# EAGLE board ra8875_ez80_2_1 (EAGLE 7.3.0), part 1 of 2
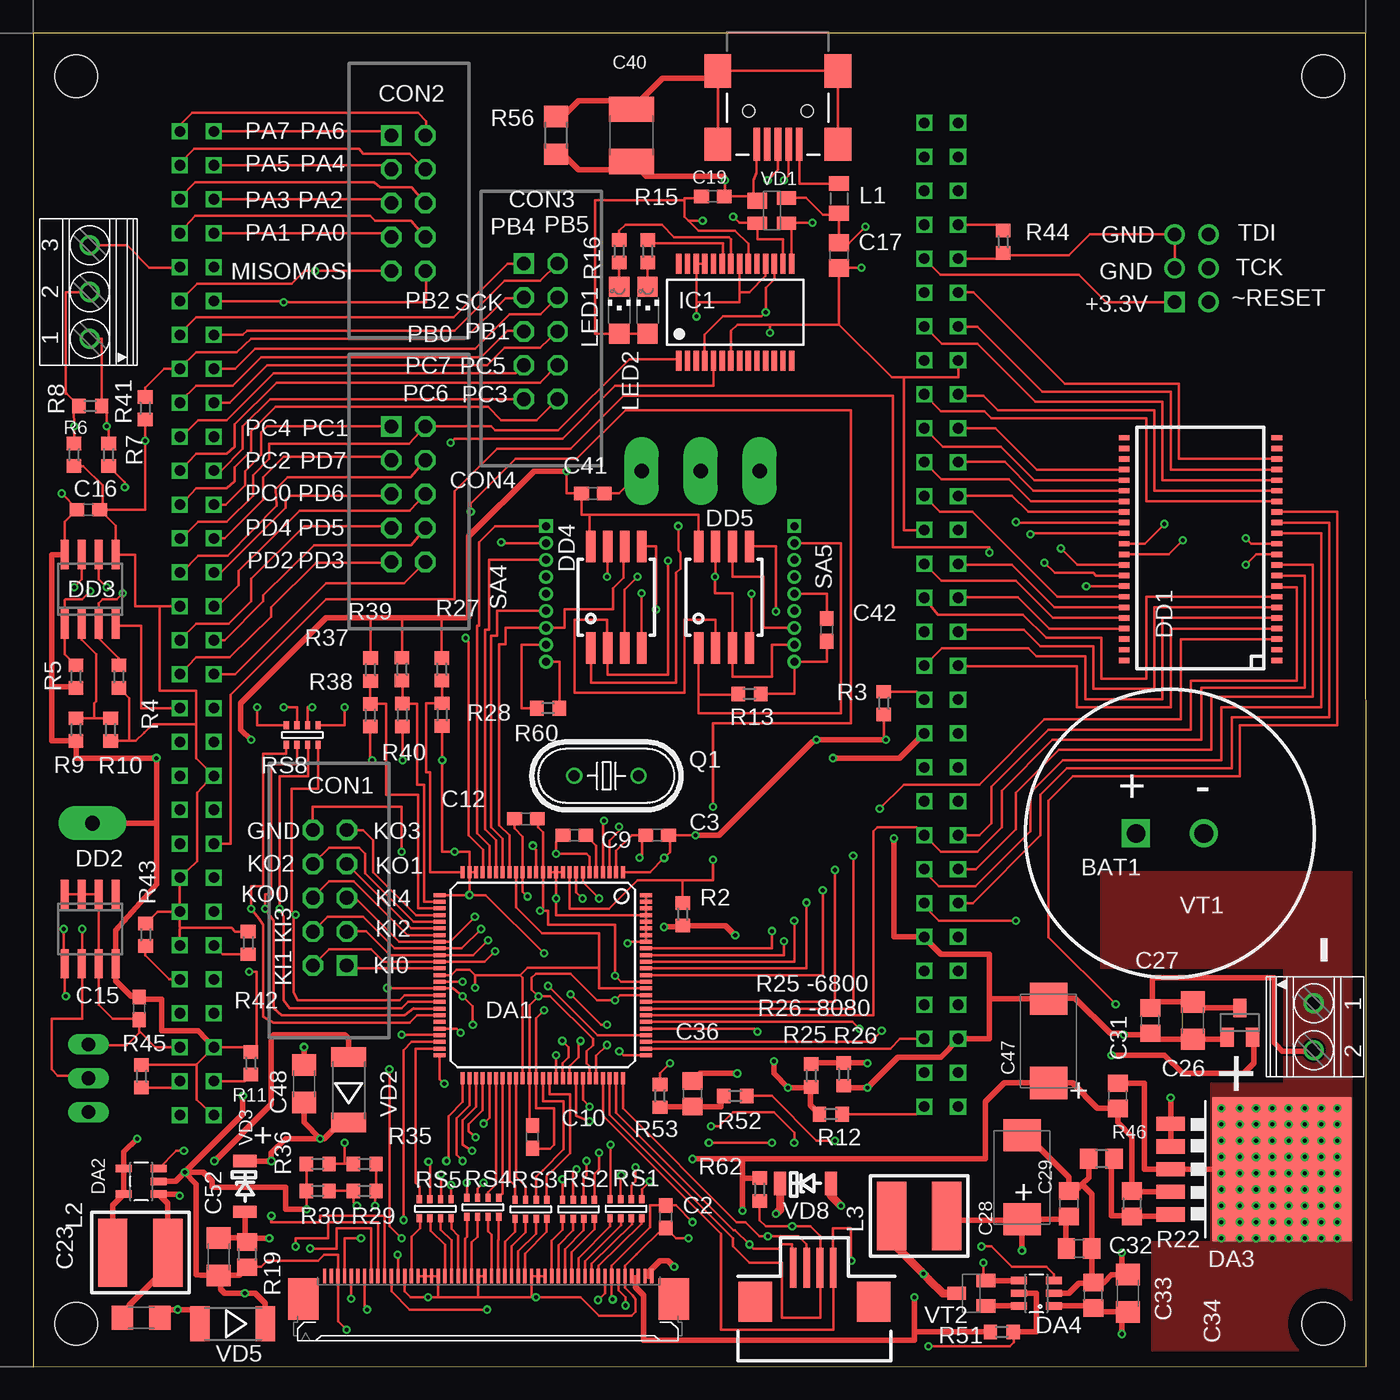
[diagram p2: board, top side]
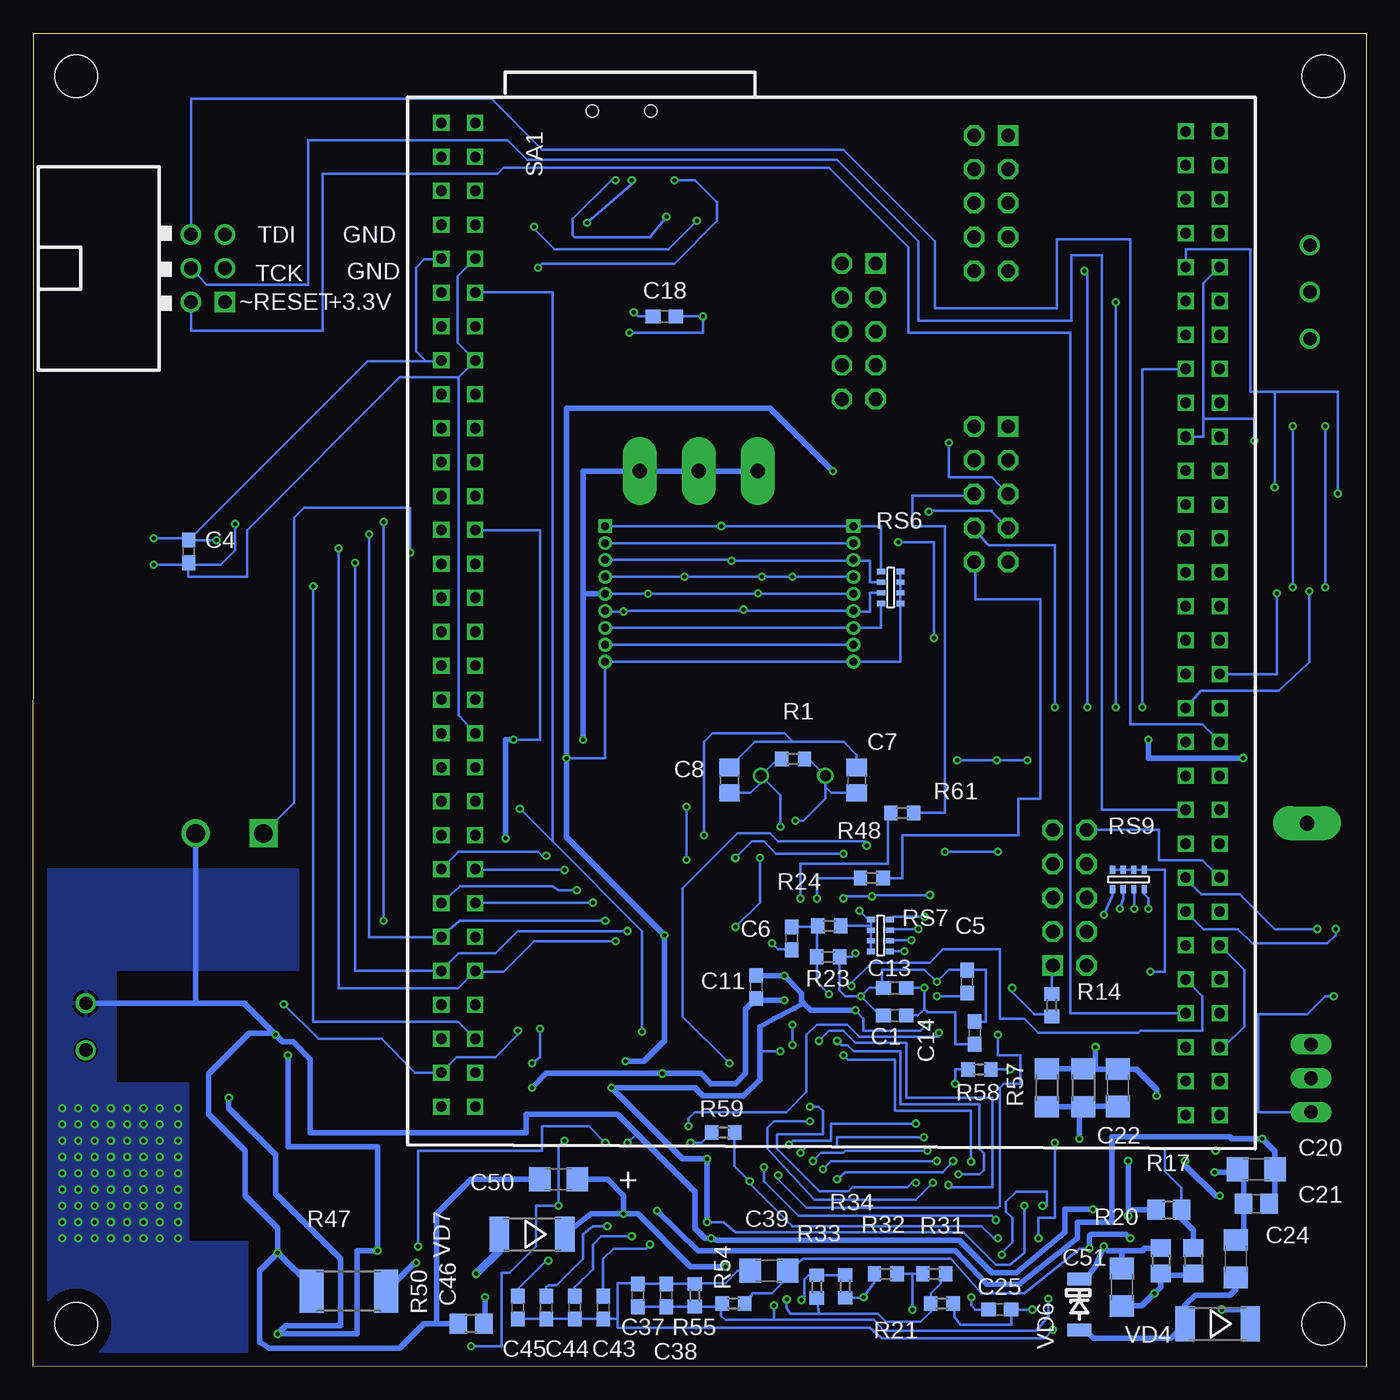
[diagram p3: board, bottom side, seen from below]

Size 99.84 x 99.83 mm. Coordinates in mm from the lower left corner, seen from the top.
Outline: 0,0 99.84,0.01 99.83,99.83 0,99.83 0,0
Copper layers (1*16): Top 0.035mm / dielectric 1.5mm / Bottom 0.035mm
Design rules "seeedstudio": minimum track width 6mil, minimum drill 11mil, track to track 6mil, track to pad 6mil, pad to pad 6mil, via to via 12mil, smd to smd 3mil, copper to edge 40mil, drill to drill 12mil, minimum pad ring 6mil, minimum via ring 6mil, stop-mask expansion 2mil, vias tented up to drill 16mil, thermal gap 10mil
Holes 3.2 mm at 3.2,96.62 96.62,96.62 96.62,3.2 3.2,3.2

## Footprints (pad centres in the part's own frame; a part is rotated, then mirrored left to right if it is on the bottom)
EECF5R5U155 = drill 1.4 square: + 0,0 | drill 1.4: - 5.08,0
C0603 = smd 1.1 x 1: 1 -0.85,0; 2 0.85,0
C0805 = smd 1.3 x 1.5: 1 -0.95,0; 2 0.95,0
C1206 = smd 1.6 x 1.8: 1 -1.4,0; 2 1.4,0
SMC_D = smd 2.4 x 2.8: + -3.15,0; - 3.15,0
C1812 = smd 1.9 x 3.4: 1 -1.95,0; 2 1.95,0
FPC_1MM-4 = smd 0.5 x 3: 1 0,0; 2 1,0; 3 2,0; 4 3,0 | smd 2.5 x 3: NC -2.857,-2.54; NC1 6.032,-2.54
IDC10 = drill 1.02 square: 1 0,0 | drill 1.02 octagon: 2 0,2.54; 3 2.54,0; 4 2.54,2.54; 5 5.08,0; 6 5.08,2.54; 7 7.62,0; 8 7.62,2.54; 9 10.16,0; 10 10.16,2.54
LQFP100 = smd 0.9 x 0.3: 1 -7.72,6; 2 -7.72,5.5; 3 -7.72,5; 4 -7.72,4.5; 5 -7.72,4; 6 -7.72,3.5; 7 -7.72,3; 8 -7.72,2.5; 9 -7.72,2; 10 -7.72,1.5; 11 -7.72,1; 12 -7.72,0.5; 13 -7.72,0; 14 -7.72,-0.5; 15 -7.72,-1; 16 -7.72,-1.5; 17 -7.72,-2; 18 -7.72,-2.5; 19 -7.72,-3; 20 -7.72,-3.5; 21 -7.72,-4; 22 -7.72,-4.5; 23 -7.72,-5; 24 -7.72,-5.5; 25 -7.72,-6; 51 7.72,-6; 52 7.72,-5.5; 53 7.72,-5; 54 7.72,-4.5; 55 7.72,-4; 56 7.72,-3.5; 57 7.72,-3; 58 7.72,-2.5; 59 7.72,-2; 60 7.72,-1.5; 61 7.72,-1; 62 7.72,-0.5; 63 7.72,0; 64 7.72,0.5; 65 7.72,1; 66 7.72,1.5; 67 7.72,2; 68 7.72,2.5; 69 7.72,3; 70 7.72,3.5; 71 7.72,4; 72 7.72,4.5; 73 7.72,5; 74 7.72,5.5; 75 7.72,6 | smd 0.3 x 0.9: 26 -6,-7.72; 27 -5.5,-7.72; 28 -5,-7.72; 29 -4.5,-7.72; 30 -4,-7.72; 31 -3.5,-7.72; 32 -3,-7.72; 33 -2.5,-7.72; 34 -2,-7.72; 35 -1.5,-7.72; 36 -1,-7.72; 37 -0.5,-7.72; 38 0,-7.72; 39 0.5,-7.72; 40 1,-7.72; 41 1.5,-7.72; 42 2,-7.72; 43 2.5,-7.72; 44 3,-7.72; 45 3.5,-7.72; 46 4,-7.72; 47 4.5,-7.72; 48 5,-7.72; 49 5.5,-7.72; 50 6,-7.72; 76 6,7.72; 77 5.5,7.72; 78 5,7.72; 79 4.5,7.72; 80 4,7.72; 81 3.5,7.72; 82 3,7.72; 83 2.5,7.72; 84 2,7.72; 85 1.5,7.72; 86 1,7.72; 87 0.5,7.72; 88 0,7.72; 89 -0.5,7.72; 90 -1,7.72; 91 -1.5,7.72; 92 -2,7.72; 93 -2.5,7.72; 94 -3,7.72; 95 -3.5,7.72; 96 -4,7.72; 97 -4.5,7.72; 98 -5,7.72; 99 -5.5,7.72; 100 -6,7.72
SOT23-5L = smd 0.55 x 1.2: 1 -0.95,-1.3; 2 0,-1.3; 3 0.95,-1.3; 4 0.95,1.3; 5 -0.95,1.3
TO263-5 = smd 1.067 x 2.159: 1 -3.404,-5.791; 2 -1.702,-5.791; 3 0,-5.791; 4 1.702,-5.791; 5 3.404,-5.791 | smd 10.8 x 10.41: 6 0,2.54
SOT23-6L = smd 0.55 x 1.2: 1 -0.95,-1.3; 2 0,-1.3; 3 0.95,-1.3; 4 0.95,1.3; 5 0,1.3; 6 -0.95,1.3
TSOP_Z44_II = smd 0.4 x 0.8: 1 0,0; 2 0.794,0; 3 1.587,0; 4 2.381,0; 5 3.175,0; 6 3.969,0; 7 4.763,0; 8 5.556,0; 9 6.35,0; 10 7.144,0; 11 7.938,0; 12 8.731,0; 13 9.525,0; 14 10.319,0; 15 11.113,0; 16 11.906,0; 17 12.7,0; 18 13.494,0; 19 14.287,0; 20 15.081,0; 21 15.875,0; 22 16.669,0; 23 16.669,11.43; 24 15.875,11.43; 25 15.081,11.43; 26 14.287,11.43; 27 13.494,11.43; 28 12.7,11.43; 29 11.906,11.43; 30 11.113,11.43; 31 10.319,11.43; 32 9.525,11.43; 33 8.731,11.43; 34 7.938,11.43; 35 7.144,11.43; 36 6.35,11.43; 37 5.556,11.43; 38 4.763,11.43; 39 3.969,11.43; 40 3.175,11.43; 41 2.381,11.43; 42 1.587,11.43; 43 0.794,11.43; 44 0,11.43
SOIC8 = smd 0.6 x 2.2: 1 -1.905,-2.6; 2 -0.635,-2.6; 3 0.635,-2.6; 4 1.905,-2.6; 5 1.905,2.6; 6 0.635,2.6; 7 -0.635,2.6; 8 -1.905,2.6
SO8 = smd 0.6 x 2.2: 1 -1.905,-2.6; 2 -0.635,-2.6; 3 0.635,-2.6; 4 1.905,-2.6; 5 1.905,2.6; 6 0.635,2.6; 7 -0.635,2.6; 8 -1.905,2.6
SOIC-208 = smd 0.7 x 2.36: 1 0,0; 2 1.27,0; 3 2.54,0; 4 3.81,0; 5 3.81,7.62; 6 2.54,7.62; 7 1.27,7.62; 8 0,7.62
SSOP28 = smd 0.4 x 1.5: 1 -4.225,-3.625; 2 -3.575,-3.625; 3 -2.925,-3.625; 4 -2.275,-3.625; 5 -1.625,-3.625; 6 -0.975,-3.625; 7 -0.325,-3.625; 8 0.325,-3.625; 9 0.975,-3.625; 10 1.625,-3.625; 11 2.275,-3.625; 12 2.925,-3.625; 13 3.575,-3.625; 14 4.225,-3.625; 15 4.225,3.625; 16 3.575,3.625; 17 2.925,3.625; 18 2.275,3.625; 19 1.625,3.625; 20 0.975,3.625; 21 0.325,3.625; 22 -0.325,3.625; 23 -0.975,3.625; 24 -1.625,3.625; 25 -2.275,3.625; 26 -2.925,3.625; 27 -3.575,3.625; 28 -4.225,3.625
4-1734839-0 = smd 0.25 x 1.1: 1 -11.973,-2.54; 2 -11.473,-2.54; 3 -10.973,-2.54; 4 -10.473,-2.54; 5 -9.973,-2.54; 6 -9.473,-2.54; 7 -8.973,-2.54; 8 -8.473,-2.54; 9 -7.973,-2.54; 10 -7.473,-2.54; 11 -6.973,-2.54; 12 -6.473,-2.54; 13 -5.973,-2.54; 14 -5.473,-2.54; 15 -4.973,-2.54; 16 -4.473,-2.54; 17 -3.973,-2.54; 18 -3.473,-2.54; 19 -2.973,-2.54; 20 -2.473,-2.54; 21 -1.972,-2.54; 22 -1.472,-2.54; 23 -0.973,-2.54; 24 -0.472,-2.54; 25 0.028,-2.54; 26 0.527,-2.54; 27 1.028,-2.54; 28 1.528,-2.54; 29 2.027,-2.54; 30 2.527,-2.54; 31 3.027,-2.54; 32 3.527,-2.54; 33 4.027,-2.54; 34 4.527,-2.54; 35 5.027,-2.54; 36 5.527,-2.54; 37 6.027,-2.54; 38 6.527,-2.54; 39 7.027,-2.54; 40 7.527,-2.54; 41 8.039,-2.54; 42 8.539,-2.54; 43 9.039,-2.54; 44 9.539,-2.54; 45 10.039,-2.54; 46 10.539,-2.54; 47 11.039,-2.54; 48 11.539,-2.54; 49 12.039,-2.54; 50 12.539,-2.54 | smd 2.3 x 3.1: M1 14.119,-0.84; M2 -13.623,-0.84
R0805 = smd 1.1 x 1.5: 1 -1.109,0; 2 1.109,0
VLS6045 = smd 2.2 x 5.1: P$1 0,0; P$2 4.128,0
CHIPLED_1206 = smd 1.5 x 1.5: A 0,-1.75; C 0,1.75
HC49U70 = drill 0.813: 1 -2.413,0; 2 2.413,0
R0603 = smd 1 x 1.1: 1 -0.85,0; 2 0.85,0
R0805' = smd 1.3 x 1.5: 1 -0.95,0; 2 0.95,0
R2512 = smd 1.8 x 3.2: 1 -2.8,0; 2 2.8,0
R1206 = smd 1.6 x 1.803: 1 -1.422,0; 2 1.422,0
CAY16-4 = smd 0.6 x 0.4: 1 0,0; 2 0,-0.794; 3 0,-1.587; 4 0,-2.381; 5 1.429,-2.381; 6 1.429,-1.587; 7 1.429,-0.794; 8 1.429,0
EZ80F916050MODG = drill 0.8 square: JP1_1 0,0; JP1_2 0,2.54; JP1_3 2.54,0; JP1_4 2.54,2.54; JP1_5 5.08,0; JP1_6 5.08,2.54; JP1_7 7.62,0; JP1_8 7.62,2.54; JP1_9 10.16,0; JP1_10 10.16,2.54; JP1_11 12.7,0; JP1_12 12.7,2.54; JP1_13 15.24,0; JP1_14 15.24,2.54; JP1_15 17.78,0; JP1_16 17.78,2.54; JP1_17 20.32,0; JP1_18 20.32,2.54; JP1_19 22.86,0; JP1_20 22.86,2.54; JP1_21 25.4,0; JP1_22 25.4,2.54; JP1_23 27.94,0; JP1_24 27.94,2.54; JP1_25 30.48,0; JP1_26 30.48,2.54; JP1_27 33.02,0; JP1_28 33.02,2.54; JP1_29 35.56,0; JP1_30 35.56,2.54; JP1_31 38.1,0; JP1_32 38.1,2.54; JP1_33 40.64,0; JP1_34 40.64,2.54; JP1_35 43.18,0; JP1_36 43.18,2.54; JP1_37 45.72,0; JP1_38 45.72,2.54; JP1_39 48.26,0; JP1_40 48.26,2.54; JP1_41 50.8,0; JP1_42 50.8,2.54; JP1_43 53.34,0; JP1_44 53.34,2.54; JP1_45 55.88,0; JP1_46 55.88,2.54; JP1_47 58.42,0; JP1_48 58.42,2.54; JP1_49 60.96,0; JP1_50 60.96,2.54; JP1_51 63.5,0; JP1_52 63.5,2.54; JP1_53 66.04,0; JP1_54 66.04,2.54; JP1_55 68.58,0; JP1_56 68.58,2.54; JP1_57 71.12,0; JP1_58 71.12,2.54; JP1_59 73.66,0; JP1_60 73.66,2.54; JP2_1 0.635,55.761; JP2_2 0.635,58.301; JP2_3 3.175,55.761; JP2_4 3.175,58.301; JP2_5 5.715,55.761; JP2_6 5.715,58.301; JP2_7 8.255,55.761; JP2_8 8.255,58.301; JP2_9 10.795,55.761; JP2_10 10.795,58.301; JP2_11 13.335,55.761; JP2_12 13.335,58.301; JP2_13 15.875,55.761; JP2_14 15.875,58.301; JP2_15 18.415,55.761; JP2_16 18.415,58.301; JP2_17 20.955,55.761; JP2_18 20.955,58.301; JP2_19 23.495,55.761; JP2_20 23.495,58.301; JP2_21 26.035,55.761; JP2_22 26.035,58.301; JP2_23 28.575,55.761; JP2_24 28.575,58.301; JP2_25 31.115,55.761; JP2_26 31.115,58.301; JP2_27 33.655,55.761; JP2_28 33.655,58.301; JP2_29 36.195,55.761; JP2_30 36.195,58.301; JP2_31 38.735,55.761; JP2_32 38.735,58.301; JP2_33 41.275,55.761; JP2_34 41.275,58.301; JP2_35 43.815,55.761; JP2_36 43.815,58.301; JP2_37 46.355,55.761; JP2_38 46.355,58.301; JP2_39 48.895,55.761; JP2_40 48.895,58.301; JP2_41 51.435,55.761; JP2_42 51.435,58.301; JP2_43 53.975,55.761; JP2_44 53.975,58.301; JP2_45 56.515,55.761; JP2_46 56.515,58.301; JP2_47 59.055,55.761; JP2_48 59.055,58.301; JP2_49 61.595,55.761; JP2_50 61.595,58.301; JP2_51 64.135,55.761; JP2_52 64.135,58.301; JP2_53 66.675,55.761; JP2_54 66.675,58.301; JP2_55 69.215,55.761; JP2_56 69.215,58.301; JP2_57 71.755,55.761; JP2_58 71.755,58.301; JP2_59 74.295,55.761; JP2_60 74.295,58.301
3PIN-254 = drill 1.02 long: 1 0,0; 2 2.54,0; 3 5.08,0
ZPAKII = drill 1.02 square: 1 0,0 | drill 1.02: 2 2.54,0; 3 0,-2.54; 4 2.54,-2.54; 5 0,-5.08; 6 2.54,-5.08
H_IDC8X1_27 = drill 0.6 pad 1.016 square: 1 0,0 | drill 0.6 pad 1.016: 2 1.27,0; 3 2.54,0; 4 3.81,0; 5 5.08,0; 6 6.35,0; 7 7.62,0; 8 8.89,0; 9 10.16,0
USB-MINIB = smd 2.5 x 0.5: D+ 2.5,0; D- 2.5,0.8; GND 2.5,-1.6; ID 2.5,-0.8; VBUS 2.5,1.6 | smd 2.5 x 2: MTN1 -3,4.5; MTN2 2.5,4.5; MTN3 -3,-4.5; MTN4 2.5,-4.5 | hole 0.9: 0,2.2; 0,-2.2
1_PIN_2_54 = drill 1.1 pad 2.54 long: P$1 0,0
SOT143B = smd 1.2 x 1.44: 1 -0.75,-1.1 | smd 1 x 1.44: 2 0.95,-1.1; 3 0.95,1.1; 4 -0.95,1.1
MELF-MLL41 = smd 1.45 x 2.6: A 2.445,0; C -2.445,0
STABILITRON = smd 0.914 x 1.778: A 0,0; C 3.81,0
SOT23 = smd 1 x 1.4: 1 -0.95,-1.1; 2 0.95,-1.1; 3 0,1.1
SOT23-BEC = smd 1 x 1.4: B -0.95,-1.1; C 0,1.1; E 0.95,-1.1
1751251 = drill 1: 1 -3.5,-0.1; 2 0,-0.1; 3 3.5,-0.1
1751248 = drill 1: 1 -1.75,-0.1; 2 1.75,-0.1

## Placement (x,y rotation side)
BAT1  [EECF5R5U155]  82.6,39.93 0 top
C1  1uF  [C0603]  35.31,26.29 180 bottom
C2  0.1uF  [C0603]  47.37,11.21 270 top
C3  0.1uF  [C0603]  46.74,39.79 0 top
C4  0.1uF  [C0603]  88.2,61.04 90 bottom
C5  0.1uF  [C0603]  29.9,28.83 90 bottom
C6  1uF  [C0603]  43.03,32.07 270 bottom
C7  20pF  [C0805]  38.16,43.92 90 bottom
C8  20pF  [C0805]  47.69,43.92 90 bottom
C9  1uF  [C0603]  40.53,39.79 180 top
C10  0.1uF  [C0603]  37.4,17.2 90 top
C11  0.1uF  [C0603]  45.68,28.42 270 bottom
C12  0.1uF  [C0603]  36.89,41.02 180 top
C13  0.1uF  [C0603]  35.31,28.36 180 bottom
C14  0.1uF  [C0603]  29.32,24.98 90 bottom
C15  0.1uF  [C0603]  7.92,26.82 270 top
C16  0.1uF  [C0603]  4.11,64.16 0 top
C17  4.7uF  [C0805]  60.35,83.21 270 top
C18  0.1uF  [C0603]  52.58,78.64 180 bottom
C19  1uF  [C0603]  50.9,87.63 0 top
C20  10uF  [C1206]  8.23,14.78 180 bottom
C21  0.1uF  [C0805]  8.23,12.19 180 bottom
C22  10uFx25V  [C1206]  18.59,20.88 90 bottom
C23  0.1uF  [C1206]  8.08,3.66 180 top
C24  10uFx25V  [C1206]  9.75,8.08 90 bottom
C25  1uF  [C0603]  27.43,4.27 180 bottom
C26  10uF  [C1206]  86.87,25.91 270 top
C27  0.1uF  [C0805]  83.67,25.91 270 top
C28  470uFx16V  [SMC_D]  74.07,14.17 90 top
C29  0.1uF  [C0805]  77.57,12.19 90 top
C31  0.1uF  [C0805]  81.23,20.27 90 top
C32  0.01uF  [C0805]  78.33,8.84 0 top
C33  0.1uF  [C0805]  79.4,5.33 90 top
C34  10uF  [C1206]  81.99,5.49 90 top
C36  0.1uF  [C0805]  49.38,20.42 90 top
C37  1uF  [C0603]  54.56,5.33 90 bottom
C38  1uF  [C0603]  52.43,5.33 90 bottom
C39  10uF  [C1206]  44.73,7.16 180 bottom
C40  1000pFx250v  [C1812]  44.81,92.2 270 top
C41  0.1uF  [C0603]  41.91,65.38 0 top
C42  0.1uF  [C0603]  59.44,55.17 90 top
C43  30pF  [C0603]  57.15,4.42 270 bottom
C44  30pF  [C0603]  59.28,4.42 270 bottom
C45  30pF  [C0603]  61.42,4.42 270 bottom
C46  30pF  [C0603]  63.55,4.42 270 bottom
C47  470uFx16V  [SMC_D]  76.05,24.38 90 top
C48  10uFx25V  [C1206]  20.27,21.18 90 top
C50  10uFx25V  [C1206]  60.5,14.02 180 bottom
C51  4.7uFx25V  [C1206]  18.29,5.94 270 bottom
C52  4.7uFx25V  [C1206]  13.87,8.23 270 top
CN1  1X4FPC1X4  [FPC_1MM-4]  56.93,7.4 0 top
CON1  IDC10  [IDC10]  23.47,30.02 90 top
CON2  IDC10  [IDC10]  26.82,92.2 270 top
CON3  IDC10  [IDC10]  36.73,82.6 270 top
CON4  IDC10  [IDC10]  26.82,70.41 270 top
DA1  RA8875  [LQFP100]  38.16,29.31 270 top
DA2  tps61040  [SOT23-5L]  8.08,13.87 90 top
DA3  MIC29302  [TO263-5]  90.98,14.78 270 top
DA4  ZXSC400  [SOT23-6L]  75.13,5.49 90 top
DD1  cy7c1049  [TSOP_Z44_II]  93.14,52.88 90 top
DD2  M24M01  [SOIC8]  4.27,32.77 180 top
DD3  ADM3485E  [SO8]  4.27,58.22 0 top
DD4  W25Q32  [SOIC-208]  41.76,53.8 0 top
DD5  W25Q32  [SOIC-208]  49.83,53.8 0 top
IC1  FT232RL  [SSOP28]  52.58,78.94 0 top
J1  40PINFPC  [4-1734839-0]  34.35,4.23 180 top
L1  [R0805]  60.35,87.48 270 top
L2  10uH VLS6045EX  [VLS6045]  5.94,8.53 0 top
L3  10uH VLS6045EX  [VLS6045]  68.43,11.28 180 top
LED1  GREEN  [CHIPLED_1206]  43.89,79.1 0 top
LED2  RED  [CHIPLED_1206]  46.02,79.1 0 top
Q1  20.000MHz  [HC49U70]  42.93,44.23 180 top
R1  1M  [R0603]  42.93,45.5 0 bottom
R2  10K  [R0603]  48.64,33.87 270 top
R3  NOT  [R0603]  63.7,49.68 270 top
R4  10K  [R0603]  6.4,51.66 270 top
R5  10K  [R0603]  3.2,51.66 90 top
R6  560  [R0603]  3.05,68.28 270 top
R7  560  [R0603]  5.64,68.28 90 top
R8  120  [R0603]  4.27,71.93 180 top
R9  NOT  [R0603]  3.2,47.7 90 top
R10  00  [R0603]  5.79,47.7 270 top
R11  10K  [R0603]  16.31,22.71 270 top
R12  10K  [R0603]  59.74,18.9 180 top
R13  10K  [R0603]  53.64,50.37 180 top
R14  100K  [R0603]  23.55,27.05 270 bottom
R15  330  [R0603]  46.02,83.52 270 top
R16  330  [R0603]  43.89,83.52 270 top
R17  115K  [R0805']  14.78,11.73 0 bottom
R18  9.53K  [R0805']  12.95,7.92 270 bottom
R19  1K  [R0805']  16,8.38 270 top
R20  10K  [R0805']  15.39,7.92 270 bottom
R21  10K  [R0603]  31.78,4.72 0 bottom
R22  274  [R0805']  82.3,12.19 270 top
R23  10K  [R0603]  40.3,30.68 0 bottom
R24  10K  [R0603]  40.22,33.01 180 bottom
R25  NOT  [R0603]  58.28,21.79 90 top
R26  00  [R0603]  60.69,21.88 270 top
R27  NOT  [R0603]  30.59,52.22 270 top
R28  00  [R0603]  30.62,48.82 270 top
R29  NOT  [R0603]  24.83,13.16 180 top
R30  00  [R0603]  21.31,13.16 180 top
R31  10K  [R0603]  32.35,6.95 180 bottom
R32  NOT  [R0603]  35.98,6.95 180 bottom
R33  NOT  [R0603]  41.15,5.98 90 bottom
R34  00  [R0603]  39.01,6.01 270 bottom
R35  NOT  [R0603]  24.83,15.18 180 top
R36  00  [R0603]  21.31,15.18 180 top
R37  NOT  [R0603]  25.26,52.2 270 top
R38  00  [R0603]  25.23,48.77 270 top
R39  NOT  [R0603]  27.61,52.23 270 top
R40  00  [R0603]  27.65,48.79 270 top
R41  10K  [R0603]  8.38,71.77 270 top
R42  00  [R0603]  16.09,31.72 270 top
R43  00  [R0603]  8.42,32.33 90 top
R44  00  [R0603]  72.66,84.23 90 top
R45  10K  [R0603]  8.1,21.74 90 top
R46  165  [R0805']  80.01,15.54 180 top
R47  0.01  [R2512]  76.2,5.64 180 bottom
R48  330  [R0603]  37.03,36.58 180 bottom
R49  10K  [R1206]  21.18,20.88 90 bottom
R50  7.5  [R0805']  67.06,3.2 180 bottom
R51  10K  [R0603]  72.54,2.59 180 top
R52  67K  [R0603]  52.58,20.27 180 top
R53  10K  [R0603]  46.94,20.27 90 top
R54  10K  [R0603]  47.4,4.72 180 bottom
R55  4.7K  [R0603]  50.29,5.33 90 bottom
R56  1M  [R1206]  39.17,92.2 270 top
R57  10K  [R1206]  23.93,20.88 90 bottom
R58  NOT  [R0603]  28.96,22.25 180 bottom
R59  00  [R0603]  48.16,17.53 180 bottom
R60  10K  [R0603]  38.56,49.3 180 top
R61  330  [R0603]  34.75,41.45 180 bottom
R62  10K  [R0603]  54.41,13.26 270 top
RS1  33  [CAY16-4]  45.59,12.52 270 top
RS2  33  [CAY16-4]  42.02,12.48 270 top
RS3  33  [CAY16-4]  38.46,12.48 270 top
RS4  33  [CAY16-4]  34.86,12.64 270 top
RS5  33  [CAY16-4]  31.3,12.52 270 top
RS6  10K  [CAY16-4]  34.9,57.15 180 bottom
RS7  100K  [CAY16-4]  35.66,31.09 180 bottom
RS8  33  [CAY16-4]  21.34,48.01 270 top
RS9  10K  [CAY16-4]  16.61,37.19 270 bottom
SA1  EZ80F916050MODG  [EZ80F916050MODG]  69.28,93.13 270 bottom
SA2  3PIN-IDCLONG  [3PIN-254]  4.11,19.05 90 top
SA3  [ZPAKII]  85.5,79.71 180 bottom
SA4  H_IDC9  [H_IDC8X1_27]  38.4,62.94 270 top
SA5  H_IDC9  [H_IDC8X1_27]  57,62.94 270 top
U$3  USB-MINIB-5PIN  [USB-MINIB]  55.78,94.03 270 top
U$4  [1_PIN_2_54]  54.41,67.06 0 top
U$5  [1_PIN_2_54]  49.99,67.06 0 top
U$6  [1_PIN_2_54]  45.57,67.06 0 top
U$9  [1_PIN_2_54]  4.42,40.69 90 top
VD1  PRTR5V0U2X  [SOT143B]  55.32,86.56 270 top
VD2  sm5819  [MELF-MLL41]  23.62,20.73 90 top
VD3  BZV55-5V6  [STABILITRON]  15.85,11.58 90 top
VD4  sm5819  [MELF-MLL41]  11.13,3.2 180 bottom
VD5  sm5819  [MELF-MLL41]  14.94,3.2 180 top
VD6  BZV55-9V1  [STABILITRON]  21.49,2.74 90 bottom
VD7  sm5819  [MELF-MLL41]  62.48,9.91 180 bottom
VD8  BZV55-15V  [STABILITRON]  59.74,13.72 180 top
VT1  IRLML2244  [SOT23]  90.37,25.76 0 top
VT2  FMMT619  [SOT23-BEC]  70.26,5.49 90 top
X1  1751251  [1751251]  4.11,80.47 90 top
X2  1751248MANUF  [1751248]  96.01,25.45 270 top